# Altium schematic sheet TEG_ver4_sheet1.SchDoc
size A4
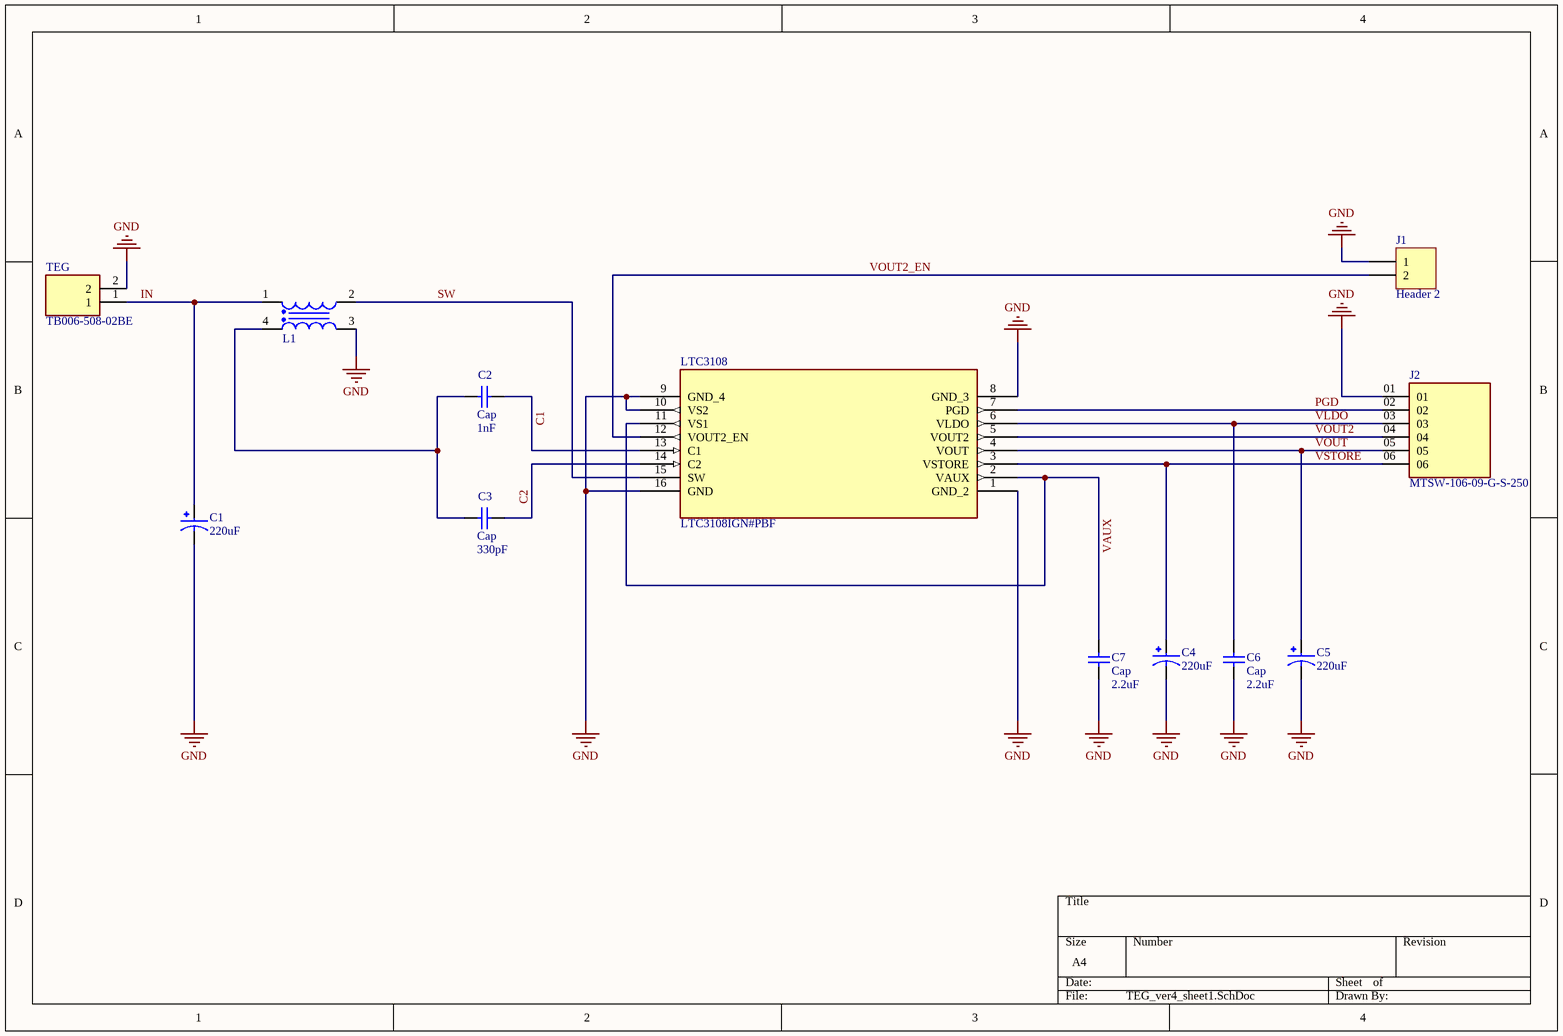
[diagram p0: TEG_ver4_sheet1.SchDoc]

## Parts
C1  220uF  [CAPPRD500W50D500H1100]
C2  Cap  value 1nF  [RAD-0.2]
C3  Cap  value 330pF  [RAD-0.2]
C4  220uF  [CAPPRD500W50D500H1100]
C5  220uF  [CAPPRD500W50D500H1100]
C6  Cap  value 2.2uF  [PCBComponent_1]
C7  Cap  value 2.2uF  [PCBComponent_1]
J1  Header 2  [HDR1X2]
J2  MTSW-106-09-G-S-250  [SAMTEC_MTSW-106-09-G-S-250]
L1  7µH / 70000µH  [WE-EHPI_5838]  (value not drawn)
LTC3108  LTC3108IGN#PBF  [PCBComponent_1]
TEG  TB006-508-02BE  [CUI_TB006-508-02BE]

## Nets
GND: C1.N C4.N C5.N C6.2 C7.2 J1.1 J2.01 L1.3 LTC3108.1(GND_2) LTC3108.8(GND_3) LTC3108.9(GND_4) LTC3108.10(VS2) LTC3108.16(GND) TEG.2
C1: C2.2 LTC3108.13(C1)
C2: C3.2 LTC3108.14(C2)
IN: C1.P L1.1 TEG.1
PGD: J2.02 LTC3108.7(PGD)
SW: L1.2 LTC3108.15(SW)
VAUX: C7.1 LTC3108.2(VAUX) LTC3108.11(VS1)
VLDO: C6.1 J2.03 LTC3108.6(VLDO)
VOUT: C5.P J2.05 LTC3108.4(VOUT)
VOUT2: J2.04 LTC3108.5(VOUT2)
VOUT2_EN: J1.2 LTC3108.12(VOUT2_EN)
VSTORE: C4.P J2.06 LTC3108.3(VSTORE)
NetC2_1: C2.1 C3.1 L1.4

## Library data of the parts
C1 C4 C5 = EEUFS0J221B: Aluminum Electrolytic Capacitors, 220uF, 6.3V, -40 to 105C; MF: Panasonic; Check_prices: https://www.snapeda.com/parts/EEUFS0J221B/Panasonic/view-part/5796863/?ref=eda; Availability: In Stock; Price: None; Package: RADIAL-2 Panasonic; Value: *; SnapEDA_Link: https://www.snapeda.com/parts/EEUFS0J221B/Panasonic/view-part/5796863/?ref=snap; Purchase-URL: https://pricing.snapeda.com/search/part/EEUFS0J221B/?ref=eda; MP: EEUFS0J221B
C2 C3 C6 C7 = Cap: Capacitor; Published: 8-Jun-2000; LatestRevisionDate: 17-Jul-2002; LatestRevisionNote: Re-released for DXP Platform.; PackageReference: RAD-0.3; Publisher: Altium Limited; PackageDescription: Radial Cap, Thru-Hole; 2 Leads; 0.3 in Pin Spacing
J1 = Header 2: Header, 2-Pin; LatestRevisionDate: 17-Jul-2002; LatestRevisionNote: Re-released for DXP Platform.; Publisher: Altium Limited
L1 = 74488540070: WE-EHPI SMT Energy Harvesting Coupled Inductor, size 5838, 7µH / 70000µH, 1:100, 1.9A; Manufacturer: Wurth Elektronik; Case/Size Code: 5838; DC Resistance 1: 0.085Ω; DC Resistance 2: 205Ω; DC Resistance Max 1: 0.095Ω; DC Resistance Max 2: 240Ω; Saturation Current: 1.3A; Manufacturer Part Number: 74488540070; Category: Coupled Power Inductors; Match Code: WE-EHPI; ComponentLink1Description: Website Link; ComponentLink1URL: https://www.we-online.com/redexpert/article/74488540070?ad; ComponentLink2Description: Datasheet Link; ComponentLink2URL: https://www.we-online.com/redexpert/spec/74488540070?ad; Mount: Surface Mount; Operating Temperature Max: 125°C; Operating Temperature Min: -40°C; Packaging: Tape and Reel; Length: 6mm; Width: 6mm; Height: 4mm; Inductance 1: 7µH; Inductance 2: 70000µH; Rated Current: 1.9A; Turns Ratio: 1:100
LTC3108 = LTC3108IGN#PBF: LTC3108 - Ultralow Voltage Step-Up Converter and Power Manager; MF: Analog Devices; SnapEDA_Link: https://www.snapeda.com/parts/LTC3108IGN%23PBF/Analog+Devices/view-part/?ref=snap; Package: SSOP-16 Linear Technology; Value: *; MP: LTC3108IGN#PBF; Check_prices: https://www.snapeda.com/parts/LTC3108IGN%23PBF/Analog+Devices/view-part/?ref=eda
TEG = TB006-508-02BE: 2~24 Poles, Screw Type, Horizontal, 5.08 Pitch, 26~14 (AWG), Terminal Block Connector; MF: Same Sky; SnapEDA_Link: https://www.snapeda.com/parts/TB006-508-02BE/Same+Sky/view-part/?ref=snap; Package: None; Value: *; MP: TB006-508-02BE; Check_prices: https://www.snapeda.com/parts/TB006-508-02BE/Same+Sky/view-part/?ref=eda
J2 = MTSW-106-09-G-S-250: Price: None; MP: MTSW-106-09-G-S-250; Availability: Unavailable; Value: *; Package: None